# EAGLE schematic SOT-23-5 (EAGLE 6.4)
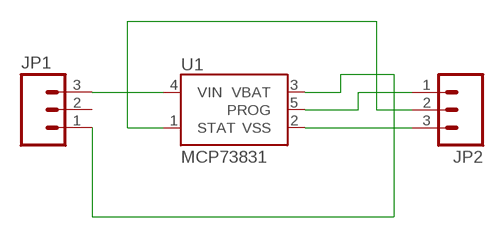
[diagram p0: schematic, sheet 1]

## Parts
JP1  M03LOCK  [1X03_LOCK]
JP2  M03LOCK  [1X03_LOCK]
U1  MCP73831  [SOT23-5]

## Nets
PROG: JP2.1 U1.5(PROG)
STAT: JP2.2 U1.1(STAT)
VBAT: JP1.1 U1.3(VBAT)
VIN: JP1.3 U1.4(VIN)
VSS: JP2.3 U1.2(VSS)
Unconnected: JP1.2

## Library data of the parts
JP1 JP2 = SparkFun:M03: Header 3 Standard 3-pin 0.1" header. Use with straight break away headers (SKU : PRT-00116), right angle break away headers (PRT-00553), swiss pins (PRT-00743), machine pins (PRT-00117), and female headers (PRT-00115). Molex polarized connector foot print use with SKU : PRT-08232 with associated crimp pins and housings.
U1 = SparkFun:MCP73831: Microchip's MCP73831 Miniature single cell, fully integrated Li-Ion, Li-polymer charge management controller http://ww1.microchip.com/downloads/en/DeviceDoc/21984a.pdf